# Altium schematic sheet PX4FLOW2.0_3DR_BUS_X0.SchDoc
size A4; DrawnBy: Philip Rowse

## Notes on the sheet
- http://www.oshwa.org/
- http://creativecommons.org/licenses/by-sa/3.0/
- Title:
- Date:
- Time:
- Sheet:
- Approved:
- of:
- Drawn By:
- Checked By:
- 3DRobotics